# EAGLE board Clock_1 (EAGLE 9.6.2)
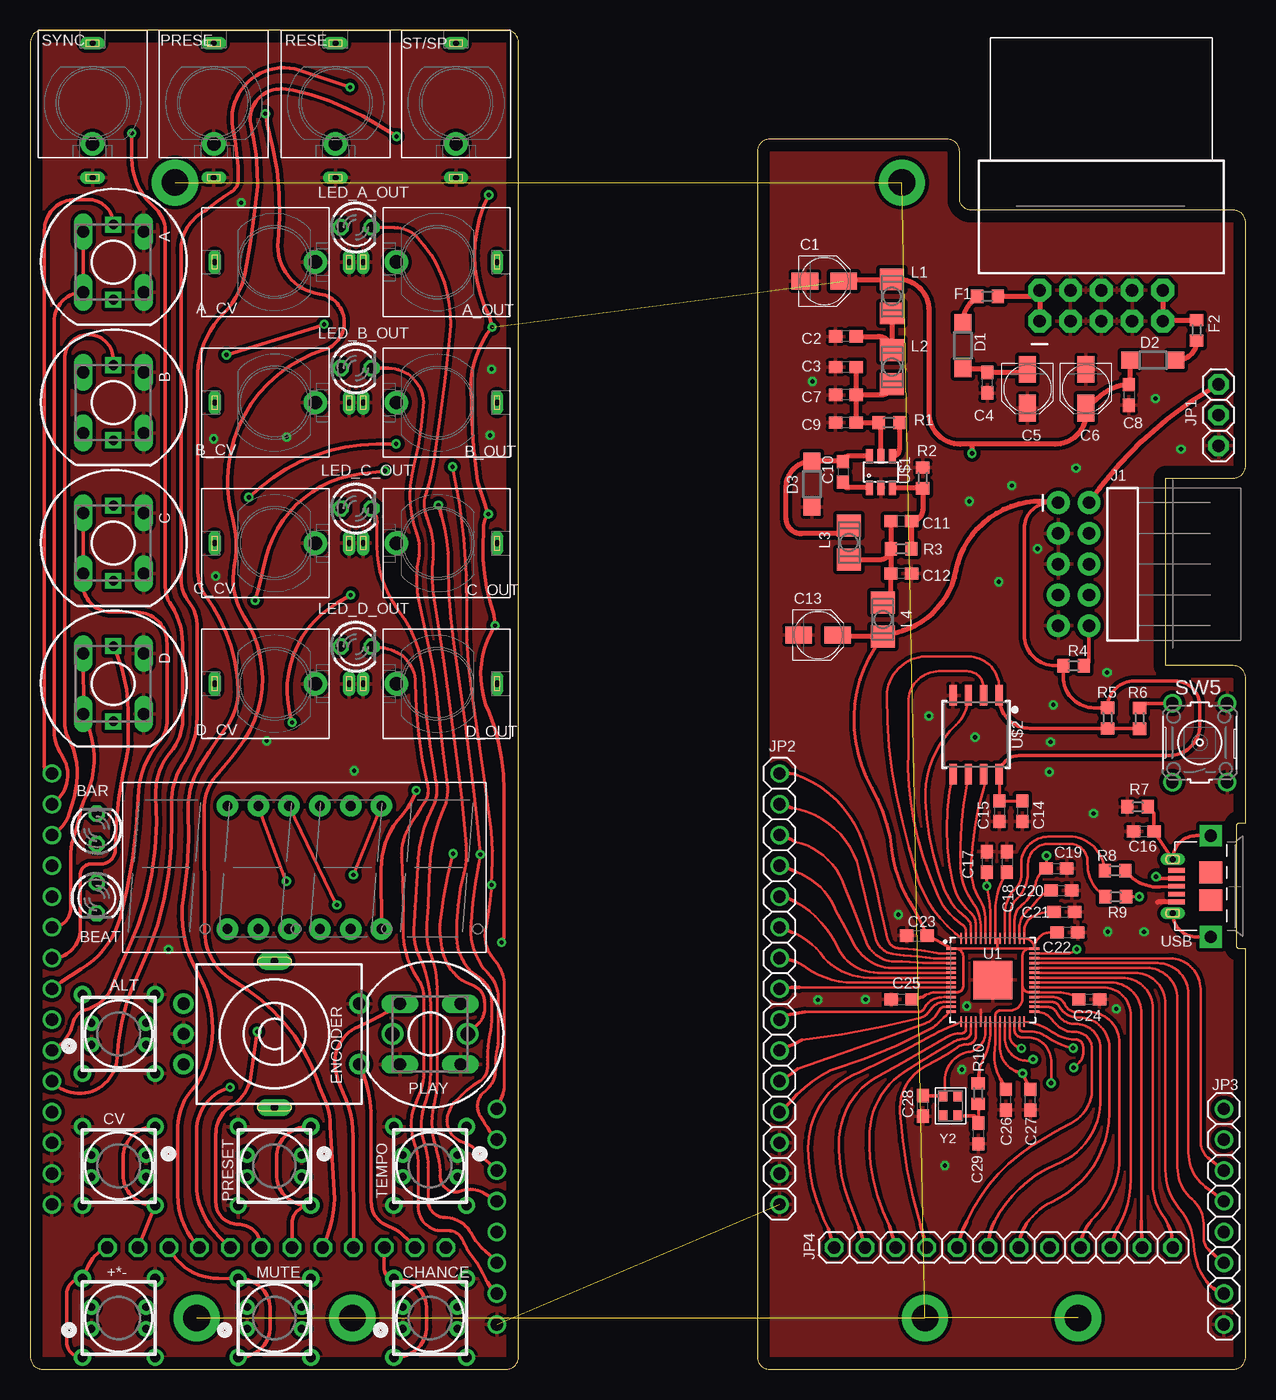
[diagram p2: board, top side]
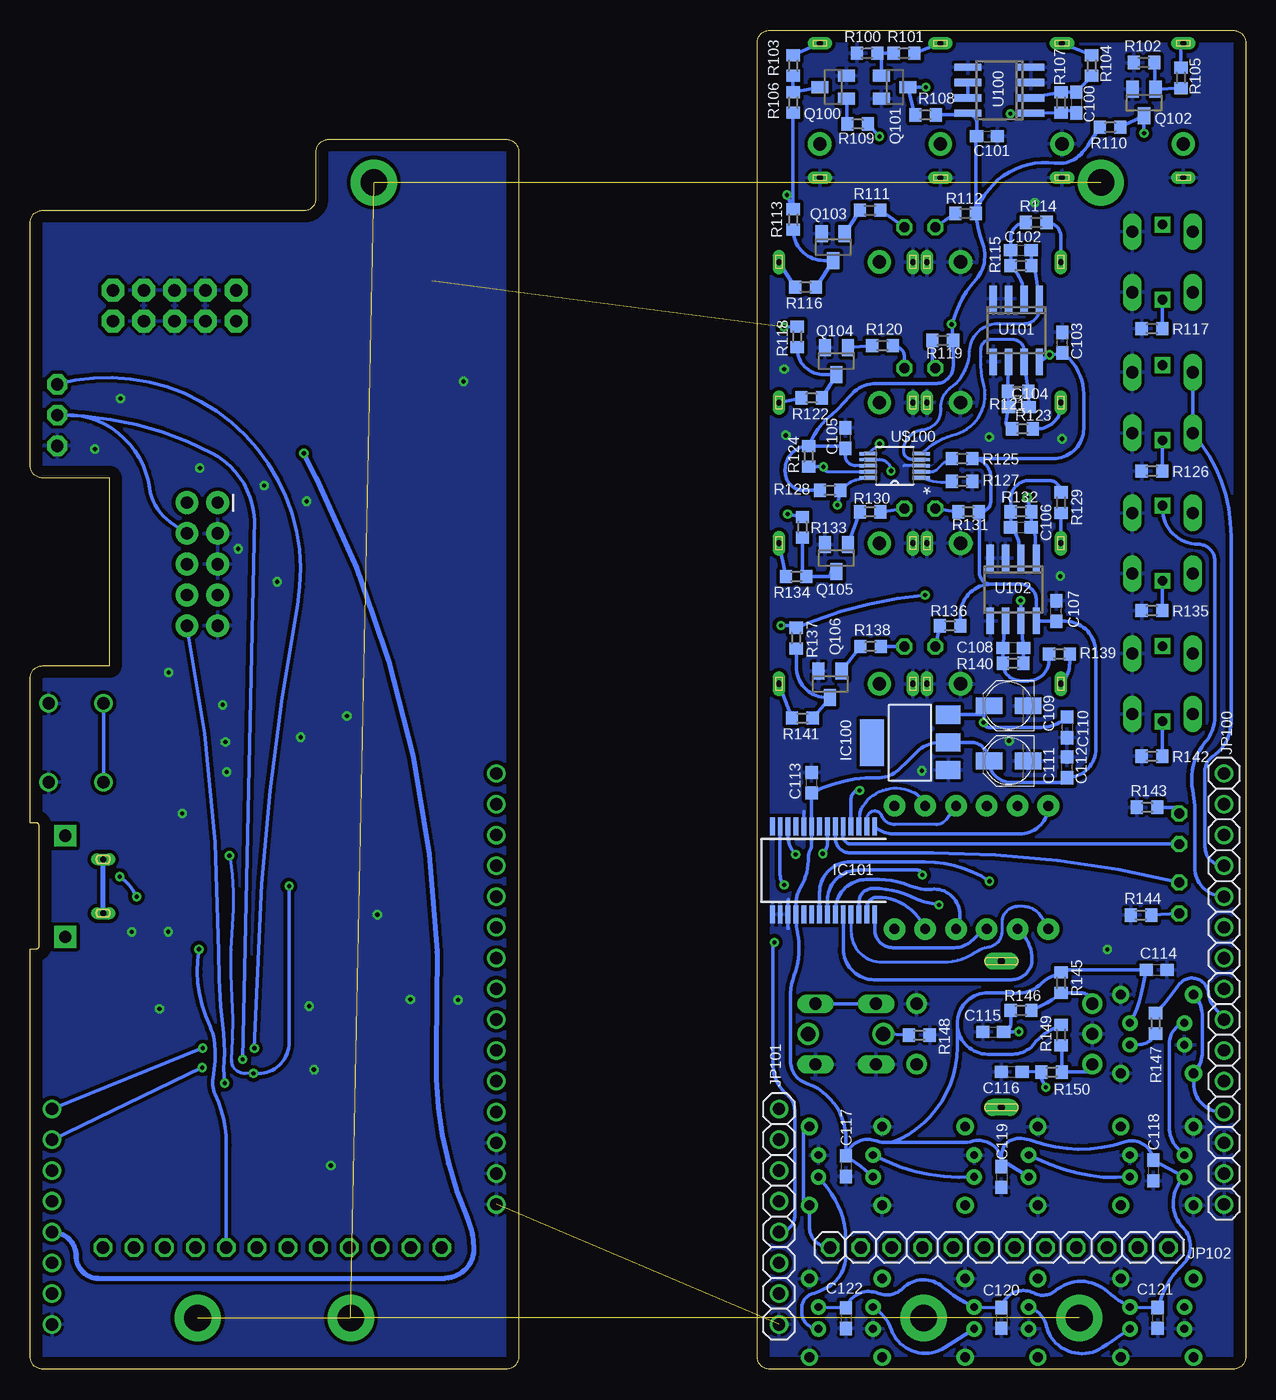
[diagram p3: board, bottom side, seen from below]

Size 100.3 x 110.5 mm. Coordinates in mm from the lower left corner, seen from the top.
Outline: 1,0 39.3,0 arc90 40.3,1 40.3,109.5 arc90 39.3,110.5 1,110.5 arc90 0,109.5 0,1 arc90 1,0
Outline: 61,0 99.3,0 arc90 100.3,1 100.3,34.69 99.82,34.69 arc-90 99.57,34.94 99.57,44.85 arc-90 99.82,45.1 100.3,45.1 100.3,57.06 arc90 99.3,58.06 93.73,58.06 93.73,73.55 99.3,73.55 arc90 100.3,74.55 100.3,94.65 arc90 99.3,95.65 77.7,95.65 arc-90 76.7,96.65 76.7,100.5 arc90 75.7,101.5 61,101.5 arc90 60,100.5 60,1 arc90 61,0
Copper layers (1*16): Top 0.035mm / dielectric 1.5mm / Bottom 0.035mm
Design rules "default": minimum track width 6mil, minimum drill 0.35mm, track to track 6mil, track to pad 6mil, pad to pad 6mil, via to via 6mil, smd to smd 6mil, copper to edge 40mil, drill to drill 6mil, minimum pad ring 10mil, minimum via ring 8mil, stop-mask expansion 4mil, vias tented up to drill 0mil, thermal gap 10mil

## Footprints (pad centres in the part's own frame; a part is rotated, then mirrored left to right if it is on the bottom)
BUTTON_PIXEL_ç = drill 0.8 pad 1.422: 1 -3,-3.25; 2 3,-3.25; 3 -3,3.25; 4 3,3.25 | drill 0.65 pad 1.27: DIN 2.25,-0.9; DOUT -2.25,0.9; GND -2.25,-0.9; VDD 2.25,0.9
TMEBUTTON = drill 1 long: 1 -2.5,2.5; 2 2.5,2.5; 3 -2.5,-2.5; 4 2.5,-2.5 | drill 0.8 square: P$1 -3.1,0; P$2 3.1,0
NOHOLER_GND_SHORT_PADMINI_GND = drill 0.5 pad 1.016 long: P1 0,-6.15; P3 0,4.92 | drill 1.1 pad 1.93: P2 0,-3.38
LED3MM = drill 0.813 octagon: A -1.27,0; K 1.27,0
PANASONIC_B = smd 2.2 x 1.4: + 1.6,0; - -1.6,0
C0603 = smd 1.1 x 1: 1 -0.85,0; 2 0.85,0
SOD123 = smd 1.4 x 1.4: A 1.9,0; C -1.9,0
CI-11 = drill 1 pad 1.676: A -2.5,-7.5; B 0,-7.5; C 2.5,-7.5; D -2.5,7; E 2.5,7 | drill 0.6 pad 1.422 long: C1 -6,0; C2 6.065,0
R0603 = smd 1 x 1.1: 1 -0.85,0; 2 0.85,0
SOT223 = smd 1.499 x 2.007: 1 -2.261,-3.15; 2 0.025,-3.15; 3 2.311,-3.15 | smd 3.81 x 2.007: 4 0,3.15
SSOP28 = smd 0.4 x 1.5: 1 -4.225,-3.625; 2 -3.575,-3.625; 3 -2.925,-3.625; 4 -2.275,-3.625; 5 -1.625,-3.625; 6 -0.975,-3.625; 7 -0.325,-3.625; 8 0.325,-3.625; 9 0.975,-3.625; 10 1.625,-3.625; 11 2.275,-3.625; 12 2.925,-3.625; 13 3.575,-3.625; 14 4.225,-3.625; 15 4.225,3.625; 16 3.575,3.625; 17 2.925,3.625; 18 2.275,3.625; 19 1.625,3.625; 20 0.975,3.625; 21 0.325,3.625; 22 -0.325,3.625; 23 -0.975,3.625; 24 -1.625,3.625; 25 -2.275,3.625; 26 -2.925,3.625; 27 -3.575,3.625; 28 -4.225,3.625
2X5-RA = drill 1.016 pad 1.88: 1 -1.27,5.08; 2 1.27,5.08; 3 -1.27,2.54; 4 1.27,2.54; 5 -1.27,0; 6 1.27,0; 7 -1.27,-2.54; 8 1.27,-2.54; 9 -1.27,-5.08; 10 1.27,-5.08
1X3* = drill 1.016 pad 1.676 octagon: 1 -2.54,0; 2 0,0; 3 2.54,0
1X15ç = drill 1.016: 1 -17.78,0; 2 -15.24,0; 3 -12.7,0; 4 -10.16,0; 5 -7.62,0; 6 -5.08,0; 7 -2.54,0; 8 0,0; 9 2.54,0; 10 5.08,0; 11 7.62,0; 12 10.16,0; 13 12.7,0; 14 15.24,0; 15 17.78,0
1X8ç = drill 1.016: 1 -8.89,0; 2 -6.35,0; 3 -3.81,0; 4 -1.27,0; 5 1.27,0; 6 3.81,0; 7 6.35,0; 8 8.89,0
1X12Ç = drill 1.016 octagon: 1 -13.97,0; 2 -11.43,0; 3 -8.89,0; 4 -6.35,0; 5 -3.81,0; 6 -1.27,0; 7 1.27,0; 8 3.81,0; 9 6.35,0; 10 8.89,0; 11 11.43,0; 12 13.97,0
L3225P = smd 1.8 x 2: 1 -1.4,0; 2 1.4,0
7-SEGMENT-4DIGIT-30MM = drill 0.8 pad 1.778: 1 -6.35,-5.08; 2 -3.81,-5.08; 3 -1.27,-5.08; 4 1.27,-5.08; 5 3.81,-5.08; 6 6.35,-5.08; 7 6.35,5.08; 8 3.81,5.08; 9 1.27,5.08; 10 -1.27,5.08; 11 -3.81,5.08; 12 -6.35,5.08
TIMEBUTTON_HOLES_LEDS = drill 1 long: 1 -2.5,2.5; 2 2.5,2.5; 3 -2.5,-2.5; 4 2.5,-2.5 | drill 1.2: P$1 -3.1,0; P$2 3.1,0
2X5-POWER_ACODADO = drill 1.016 pad 1.88 octagon: 1 -1.27,5.08; 2 1.27,5.08; 3 -1.27,2.54; 4 1.27,2.54; 5 -1.27,0; 6 1.27,0; 7 -1.27,-2.54; 8 1.27,-2.54; 9 -1.27,-5.08; 10 1.27,-5.08
SOT23 = smd 1 x 1.4: 1 -0.95,-1.1; 2 0.95,-1.1; 3 0,1.1
B3F-10XX = drill 1.016: 1 -3.251,2.261; 2 3.251,2.261; 3 -3.251,-2.261; 4 3.251,-2.261
QFN-56 = smd 0.875 x 0.2: 1 -3.437,2.6; 2 -3.437,2.2; 3 -3.437,1.8; 4 -3.437,1.4; 5 -3.437,1; 6 -3.437,0.6; 7 -3.437,0.2; 8 -3.437,-0.2; 9 -3.437,-0.6; 10 -3.437,-1; 11 -3.437,-1.4; 12 -3.437,-1.8; 13 -3.437,-2.2; 14 -3.437,-2.6; 29 3.437,-2.6; 30 3.437,-2.2; 31 3.437,-1.8; 32 3.437,-1.4; 33 3.437,-1; 34 3.437,-0.6; 35 3.437,-0.2; 36 3.437,0.2; 37 3.437,0.6; 38 3.437,1; 39 3.437,1.4; 40 3.437,1.8; 41 3.437,2.2; 42 3.437,2.6 | smd 0.2 x 0.875: 15 -2.6,-3.437; 16 -2.2,-3.437; 17 -1.8,-3.437; 18 -1.4,-3.437; 19 -1,-3.437; 20 -0.6,-3.437; 21 -0.2,-3.437; 22 0.2,-3.437; 23 0.6,-3.437; 24 1,-3.437; 25 1.4,-3.437; 26 1.8,-3.437; 27 2.2,-3.437; 28 2.6,-3.437; 43 2.6,3.437; 44 2.2,3.437; 45 1.8,3.437; 46 1.4,3.437; 47 1,3.437; 48 0.6,3.437; 49 0.2,3.437; 50 -0.2,3.437; 51 -0.6,3.437; 52 -1,3.437; 53 -1.4,3.437; 54 -1.8,3.437; 55 -2.2,3.437; 56 -2.6,3.437 | smd 3.2 x 3.2: EPAD 0,0
SO08 = smd 0.6 x 2.2: 1 -1.905,-2.6; 2 -0.635,-2.6; 3 0.635,-2.6; 4 1.905,-2.6; 5 1.905,2.6; 6 0.635,2.6; 7 -0.635,2.6; 8 -1.905,2.6
SOT23-6 = smd 0.55 x 1.2: 1 -0.95,-1.3; 2 0,-1.3; 3 0.95,-1.3; 4 0.95,1.3; 5 0,1.3; 6 -0.95,1.3
SOIC-8 = smd 0.61 x 1.702: 1 -1.905,-3.251; 2 -0.635,-3.251; 3 0.635,-3.251; 4 1.905,-3.251; 5 1.905,3.251; 6 0.635,3.251; 7 -0.635,3.251; 8 -1.905,3.251
ADC-4CH-ADS1115-VSSOP = smd 1.422 x 0.279: 1 -2.184,0.991; 2 -2.184,0.508; 3 -2.184,0; 4 -2.184,-0.508; 5 -2.184,-0.991; 6 2.184,-0.991; 7 2.184,-0.508; 8 2.184,0; 9 2.184,0.508; 10 2.184,0.991
HRS_ZX62RD-AB-5P8 = smd 0.4 x 1.35: 1 1.3,2.275; 2 0.65,2.275; 3 0,2.275; 4 -0.65,2.275; 5 -1.3,2.275 | smd 1.8 x 1.9: D_0 -1.15,-0.525; D_1 1.15,-0.525 | drill 1 pad 1.8 square: G -4.175,-0.525; G2 4.175,-0.525 | drill 0.5 long: G3 -2.225,2.6; G4 2.225,2.6
CRYSTAL_2.5X2 = smd 0.9 x 0.75: 1 -0.825,-0.625; 2 0.825,-0.625; 3 0.825,0.625; 4 -0.825,0.625

## Placement (x,y rotation side)
+*-  BUTTON_NEOPIXELBUTTON_PIXEL_ç  [BUTTON_PIXEL_ç]  7.3,4.23 0 top
A  DTS-6_LEDTME  [TMEBUTTON]  6.85,91.37 270 top
A_CV  OG-PJ301_PJ301_THONKICONNNOHOLER  [NOHOLER_GND_SHORT_PADMINI_GND]  20.15,91.37 90 top
A_OUT  OG-PJ301_PJ301_THONKICONNNOHOLER  [NOHOLER_GND_SHORT_PADMINI_GND]  33.6,91.37 270 top
ALT  BUTTON_NEOPIXELBUTTON_PIXEL_ç  [BUTTON_PIXEL_ç]  7.3,27.67 0 top
B  DTS-6_LEDTME  [TMEBUTTON]  6.85,79.77 270 top
B_CV  OG-PJ301_PJ301_THONKICONNNOHOLER  [NOHOLER_GND_SHORT_PADMINI_GND]  20.15,79.77 90 top
B_OUT  OG-PJ301_PJ301_THONKICONNNOHOLER  [NOHOLER_GND_SHORT_PADMINI_GND]  33.6,79.77 270 top
BAR  2 MM LED  [LED3MM]  5.48,44.6 90 top
BEAT  2 MM LED  [LED3MM]  5.48,38.89 270 top
C  DTS-6_LEDTME  [TMEBUTTON]  6.85,68.17 270 top
C1  10uF  [PANASONIC_B]  65.53,89.81 0 top
C2  10n  [C0603]  67.31,85.23 180 top
C3  100n  [C0603]  67.31,82.69 180 top
C4  100n  [C0603]  78.99,81.42 90 top
C5  10uF  [PANASONIC_B]  82.3,80.92 270 top
C6  10uF  [PANASONIC_B]  87.12,80.92 270 top
C7  10uF  [C0603]  67.31,80.41 180 top
C8  100n  [C0603]  90.68,80.41 270 top
C9  100n  [C0603]  67.31,78.12 180 top
C10  100n  [C0603]  67.06,74.06 270 top
C11  100n  [C0603]  71.88,69.99 180 top
C12  22uF  [C0603]  71.88,65.68 180 top
C13  10uF  [PANASONIC_B]  65.02,60.6 0 top
C14  2.2uF  [C0603]  81.87,46.05 270 top
C15  100n  [C0603]  79.97,46.05 270 top
C16  10n  [C0603]  91.89,44.37 180 top
C17  100n  [C0603]  78.94,41.87 270 top
C18  100n  [C0603]  80.61,41.86 270 top
C19  2.2uF  [C0603]  84.68,41.32 0 top
C20  2.2uF  [C0603]  85.09,39.51 0 top
C21  2.2uF  [C0603]  85.34,37.74 0 top
C22  100n  [C0603]  85.6,36.05 180 top
C23  100n  [C0603]  73.18,35.78 0 top
C24  100n  [C0603]  87.39,30.53 180 top
C25  100n  [C0603]  71.91,30.53 0 top
C26  100n  [C0603]  80.52,22.24 90 top
C27  100n  [C0603]  82.55,22.24 90 top
C28  22pF  [C0603]  73.66,21.73 90 top
C29  22pF  [C0603]  78.23,19.45 270 top
C100  100pF  [C0603]  13.97,104.54 270 bottom
C101  100n  [C0603]  21.34,101.74 0 bottom
C102  100pF  [C0603]  18.54,92.35 0 bottom
C103  100n  [C0603]  15.11,84.73 90 bottom
C104  100pF  [C0603]  18.72,79.39 0 bottom
C105  100n  [C0603]  33.02,76.85 90 bottom
C106  100pF  [C0603]  18.54,69.49 0 bottom
C107  100n  [C0603]  15.62,62.58 90 bottom
C108  100pF  [C0603]  19.18,59.53 0 bottom
C109  10uF  [PANASONIC_B]  19.56,54.75 180 bottom
C110  100n  [C0603]  14.73,52.98 270 bottom
C111  10uF  [PANASONIC_B]  19.56,50.18 180 bottom
C112  100n  [C0603]  14.73,49.67 90 bottom
C113  100n  [C0603]  35.81,48.4 90 bottom
C114  100n  [C0603]  7.34,32.96 0 bottom
C115  100nF  [C0603]  20.83,27.83 0 bottom
C116  100nF  [C0603]  19.3,24.53 180 bottom
C117  100n  [C0603]  32.99,16.76 270 bottom
C118  100n  [C0603]  7.62,16.4 270 bottom
C119  100n  [C0603]  20.14,15.87 270 bottom
C120  100n  [C0603]  20.14,4.23 270 bottom
C121  100n  [C0603]  7.26,4.23 270 bottom
C122  100n  [C0603]  32.99,4.22 270 bottom
C_CV  OG-PJ301_PJ301_THONKICONNNOHOLER  [NOHOLER_GND_SHORT_PADMINI_GND]  20.15,68.17 90 top
C_OUT  OG-PJ301_PJ301_THONKICONNNOHOLER  [NOHOLER_GND_SHORT_PADMINI_GND]  33.6,68.17 270 top
CHANCE  BUTTON_NEOPIXELBUTTON_PIXEL_ç  [BUTTON_PIXEL_ç]  33,4.23 0 top
CV  BUTTON_NEOPIXELBUTTON_PIXEL_ç  [BUTTON_PIXEL_ç]  7.3,16.77 180 top
D  DTS-6_LEDTME  [TMEBUTTON]  6.85,56.57 270 top
D1  SS1040_R1_00001  [SOD123]  76.96,84.47 270 top
D2  SS1040_R1_00001  [SOD123]  92.66,83.26 0 top
D3  SS1040_R1_00001  [SOD123]  64.52,73.04 270 top
D_CV  OG-PJ301_PJ301_THONKICONNNOHOLER  [NOHOLER_GND_SHORT_PADMINI_GND]  20.15,56.57 90 top
D_OUT  OG-PJ301_PJ301_THONKICONNNOHOLER  [NOHOLER_GND_SHORT_PADMINI_GND]  33.6,56.57 270 top
ENCODER  CI-11  [CI-11]  20.15,27.67 270 top
F1  F2  [R0603]  78.99,88.54 0 top
F2  F1  [R0603]  96.27,85.74 90 top
IC100  LM1117-3.3  [SOT223]  27.69,51.71 90 bottom
IC101  MCP23017SS  [SSOP28]  34.84,41.16 180 bottom
J1  [2X5-RA]  86.11,66.44 0 top
JP1  [1X3*]  98.07,78.75 90 top
JP2  [1X15ç]  61.83,31.39 270 top
JP3  [1X8ç]  98.51,12.59 270 top
JP4  [1X12Ç]  80.32,10.05 0 top
JP100  [1X15ç]  1.78,31.39 270 bottom
JP101  [1X8ç]  38.51,12.59 270 bottom
JP102  [1X12Ç]  20.32,10.05 180 bottom
L1  0.1uH  [L3225P]  71.12,88.54 270 top
L2  0.1uH  [L3225P]  71.12,82.69 270 top
L3  4.7uH  [L3225P]  67.56,68.22 270 top
L4  0.1uH  [L3225P]  70.36,61.87 270 top
LED_A_OUT  2 MM LED  [LED3MM]  26.88,94.24 0 top
LED_B_OUT  2 MM LED  [LED3MM]  26.88,82.62 0 top
LED_C_OUT  2 MM LED  [LED3MM]  26.88,71.04 0 top
LED_D_OUT  2 MM LED  [LED3MM]  26.88,59.64 0 top
LFD36BUE-101B  7-SEGMENT-4DIGIT-20MM  [7-SEGMENT-4DIGIT-30MM]  22.63,41.41 0 top
MUTE  BUTTON_NEOPIXELBUTTON_PIXEL_ç  [BUTTON_PIXEL_ç]  20.15,4.23 0 top
PLAY  DTS-6_LED  [TIMEBUTTON_HOLES_LEDS]  33,27.67 180 top
POWER  M05X2RAF  [2X5-POWER_ACODADO]  88.39,87.77 90 top
PRESE  OG-PJ301_PJ301_THONKICONNNOHOLER  [NOHOLER_GND_SHORT_PADMINI_GND]  15.15,104.5 0 top
PRESET  BUTTON_NEOPIXELBUTTON_PIXEL_ç  [BUTTON_PIXEL_ç]  20.15,16.77 180 top
Q100  BC846  [SOT23]  34.04,105.81 90 bottom
Q101  BC846  [SOT23]  28.96,105.81 270 bottom
Q102  BC846  [SOT23]  8.38,104.54 180 bottom
Q103  BC846  [SOT23]  34.04,92.6 180 bottom
Q104  BC846  [SOT23]  33.78,83.2 180 bottom
Q105  BC846  [SOT23]  33.78,66.95 180 bottom
Q106  BC846  [SOT23]  34.29,56.53 180 bottom
R1  100k  [R0603]  70.87,78.12 0 top
R2  16k2  [R0603]  73.66,73.55 270 top
R3  49k9  [R0603]  71.88,67.71 0 top
R4  1k  [R0603]  86.11,58.06 0 top
R5  10k  [R0603]  88.9,53.74 90 top
R6  1k  [R0603]  91.56,53.71 90 top
R7  1M  [R0603]  91.39,46.41 0 top
R8  27 Ohm  [R0603]  89.52,41.14 180 top
R9  27 Ohm  [R0603]  89.59,38.99 0 top
R10  1k  [R0603]  78.23,22.75 90 top
R100  1M  [R0603]  31.24,108.6 0 bottom
R101  100k  [R0603]  28.19,108.6 0 bottom
R102  1M  [R0603]  8.38,107.84 0 bottom
R103  100R  [R0603]  37.34,107.59 90 bottom
R104  100k  [R0603]  12.7,107.59 90 bottom
R105  100k  [R0603]  5.33,106.57 90 bottom
R106  1k  [R0603]  37.34,104.54 90 bottom
R107  33k  [R0603]  15.24,104.54 90 bottom
R108  10k  [R0603]  26.42,103.52 0 bottom
R109  1k  [R0603]  32,102.76 0 bottom
R110  10k  [R0603]  11.18,102.51 180 bottom
R111  1k  [R0603]  30.99,95.65 0 bottom
R112  470R  [R0603]  23.11,95.39 180 bottom
R113  1k  [R0603]  37.34,94.89 270 bottom
R114  100k  [R0603]  17.27,94.63 0 bottom
R115  33k  [R0603]  18.54,91.08 180 bottom
R116  100R  [R0603]  36.32,89.3 180 bottom
R117  100 Ohm  [R0603]  7.73,85.88 180 bottom
R118  1k  [R0603]  36.99,85.2 270 bottom
R119  470R  [R0603]  24.99,84.91 180 bottom
R120  1k  [R0603]  29.97,84.47 0 bottom
R121  33k  [R0603]  18.77,80.71 180 bottom
R122  100R  [R0603]  35.81,80.15 180 bottom
R123  100k  [R0603]  18.41,77.61 0 bottom
R124  10k  [R0603]  36.07,75.33 270 bottom
R125  10k  [R0603]  23.39,75.15 180 bottom
R126  100 Ohm  [R0603]  7.73,74.12 180 bottom
R127  10k  [R0603]  23.39,73.27 0 bottom
R128  10k  [R0603]  34.29,72.53 0 bottom
R129  100k  [R0603]  15.24,71.52 270 bottom
R130  1k  [R0603]  30.99,70.76 0 bottom
R131  470R  [R0603]  22.86,70.76 180 bottom
R132  33k  [R0603]  18.54,70.76 180 bottom
R133  1k  [R0603]  36.58,69.49 270 bottom
R134  100R  [R0603]  37.08,65.42 180 bottom
R135  100 Ohm  [R0603]  7.73,62.61 180 bottom
R136  470R  [R0603]  24.38,61.36 180 bottom
R137  1k  [R0603]  37.08,60.34 270 bottom
R138  1k  [R0603]  30.94,59.65 0 bottom
R139  100k  [R0603]  15.37,59.02 0 bottom
R140  33k  [R0603]  19.18,58.26 180 bottom
R141  100R  [R0603]  36.58,53.74 180 bottom
R142  100 Ohm  [R0603]  7.73,50.59 180 bottom
R143  1k  [R0603]  8.13,46.37 0 bottom
R144  1k  [R0603]  8.64,37.48 0 bottom
R145  10k  [R0603]  15.24,31.89 270 bottom
R146  10k  [R0603]  18.54,29.61 180 bottom
R147  560 Ohm  [R0603]  7.44,28.54 270 bottom
R148  100 Ohm  [R0603]  26.92,27.58 0 bottom
R149  10k  [R0603]  15.24,27.58 270 bottom
R150  10k  [R0603]  16,24.53 0 bottom
RESE  OG-PJ301_PJ301_THONKICONNNOHOLER  [NOHOLER_GND_SHORT_PADMINI_GND]  25.18,104.5 0 top
ST/SP  OG-PJ301_PJ301_THONKICONNNOHOLER  [NOHOLER_GND_SHORT_PADMINI_GND]  35.13,104.5 0 top
SW5  [B3F-10XX]  96.52,51.71 90 top
SYNC  OG-PJ301_PJ301_THONKICONNNOHOLER  [NOHOLER_GND_SHORT_PADMINI_GND]  5.14,104.5 0 top
TEMPO  BUTTON_NEOPIXELBUTTON_PIXEL_ç  [BUTTON_PIXEL_ç]  33,16.77 180 top
U1  RP2040  [QFN-56]  79.43,32.11 0 top
U100  MCP6002_  [SO08]  20.32,105.55 90 bottom
U101  MCP6002_  [SO08]  18.92,85.74 180 bottom
U102  MCP6002_  [SO08]  19.18,64.36 180 bottom
U$1  BL9342  [SOT23-6]  70.2,74.04 0 top
U$2  W25Q128JVSIQ  [SOIC-8]  78.06,52.37 180 top
U$100  ADC-4CH-ADS1115VSSOP  [ADC-4CH-ADS1115-VSSOP]  28.96,74.57 180 bottom
USB  [HRS_ZX62RD-AB-5P8]  96.89,39.86 90 top
Y2  12MHZ  [CRYSTAL_2.5X2]  75.95,21.73 90 top

## Tracks (layer width: path | path; a pad name or v marks a point on that pad's centre or on a via)
+3V3  (via drill 0.35)
  Top 0.305: v16.18,83.71 23.62,86 v24.26,86.24
  Bottom 0.254: U$100.8 32.21,74.57 arc90 33.02,75.38 C105.1
  Bottom 0.305: R108.2 22.86,103.53 | 22.86,103.53 U100.8 | C107.1 15.8,61.73 | 15.8,61.73 U102.8 17.27,63.47 arc-90 18.59,64.79 20.99,64.79 | CHANCE.VDD C122.1 arc93 30.33,6.27 arc-68 28.3,6.67 arc87 24.97,6.77 arc-14 23.16,5.53 MUTE.VDD C120.1 arc104 17.48,6.29 arc-66 15.7,6.47 arc7 15.27,6.77 arc74 11.38,6.39 arc-12 10.19,5.5 +*-.VDD C121.1 6.91,6.04 arc26 5.23,8.58 arc-90 5.16,11.68 arc90 CV.VDD C118.1 arc-102 9.98,18.76 arc38 17.58,18.84 arc-20 18.75,19.04 arc-90 20.14,17.64 C119.1 | PRESET.VDD 20.14,17.29 C119.1 | R110.2 12.83,101.29 arc6 13.46,100.42 arc58 15.72,99.53 arc-80 R112.1 | R112.1 22.26,101.74 C101.1 22.19,102.86 arc-90 22.86,103.53 | R112.1 arc-14 21.69,92.85 arc62 22.28,89.91 arc-22 23.88,87.27 v24.26,86.24 R119.1 24.13,82.97 arc0 24.13,82.77 arc92 25.6,81.35 30.45,81.35 arc-50 32.66,80.31 arc10 34.19,78.76 arc-27 R124.1 | U101.8 v16.18,83.71 C103.1 arc59 13.36,80.08 13.36,77.61 arc90 15.9,75.15 R125.1 arc90 21.03,73.56 21.03,71.56 arc90 R131.1 arc90 21.97,70.72 21.97,65.76 arc-90 20.99,64.79 | R128.1 36.45,72.53 arc90 38,74.08 38,74.25 arc90 R124.1 | C105.1 arc-90 33.2,76.18 R124.1 | 20.99,64.79 arc-90 23.53,62.25 R136.1 | ALT.VDD arc-18 8.61,31.01 C114.1 15.24,32.96 R145.1 16.15,32.33 arc-20 16.82,31.87 arc52 19.2,31.06 21.26,31.06 arc-90 23.8,28.52 | 23.8,28.52 23.8,26.53 arc69 29.18,18.71 | R149.1 16.05,28.01 arc-21 17.3,27.04 arc56 19.2,26 21.29,26 arc90 23.8,28.52 | C117.1 32.99,18.91 arc-71 36.14,23.56 arc75 37.57,25.47 37.57,30.65 arc21 37.26,32.48 arc-26 36.88,35.3 37.09,36.59 IC101.18 37.11,38.42 arc31 36.73,39.77 arc-31 36.09,42 arc22 35.92,42.89 arc-26 35.81,43.5 IC101.9 IC101.9 arc45 IC101.9 C113.1 arc29 30.43,48.81 arc-44 28.65,49.47 arc-1 28.35,49.75 arc-2 27.66,50.41 27.08,50.99 arc45 25.29,51.73 IC100.2 22.71,51.73 arc90 C111.+ arc-90 19.41,48.43 15.13,48.43 arc-90 C112.1 arc-90 12.37,51.19 12.37,59.19 arc-90 14.91,61.73 15.8,61.73
  Bottom 0.305: TEMPO.VDD 31.75,16.73 arc-11 C117.1 | 29.18,18.71 29.79,18.71 arc21 30.48,18.84 arc-94 C117.1 | C119.1 arc-111 22.45,18.84 arc13 23.57,18.71 29.18,18.71
+12V  (via drill 0.35)  (1 unrouted)
  Top 0.305: v38.89,35.22 arc45 39.12,35.86 39.12,47.77 arc22 37.85,54.22 arc-57 v38.35,61.38 38.28,62.25 arc-24 37.41,69.18 arc-42 v37.8,70.58 36.93,73.25 arc-9 36.37,81.73 arc-31 v38.1,86 37.9,86.89 arc-54 v37.85,96.92 | v26.44,63.9 25.32,63.24 arc78 v21.61,53.38
  Top 0.406: C1.+ 67.13,89.94 L1.1 71.65,89.94 arc-90 74.19,87.4 74.19,78.88 arc90 76.73,76.34 77.72,76.34 | D2.C 90.76,81.34 | 90.76,81.34 arc-90 C8.1 | 90.76,81.34 arc36 88.32,80.33 C6.+ 87.12,78.88 arc-90 84.58,76.34 77.72,76.34 | 77.72,76.34 v77.72,75.58
  Bottom 0.305: R106.1 R113.1 v37.85,96.92 | v37.8,70.58 R133.1 | v38.1,86 R118.1 | v38.35,61.38 37.02,61.38 arc90 R137.1 35.53,61.79 arc16 v26.44,63.9 | IC100.3 21.89,54.02 arc-90 C109.+ arc-90 21.61,54.3 v21.61,53.38 arc-90 21.21,52.98 16.84,52.98 arc-44 C110.1 | JP101.5 arc-90 37.21,12.61 37.21,21.38 arc-52 37.82,22.62 arc50 39.01,25.29 39.01,34.91 arc45 v38.89,35.22 | 96.52,9.33 96.52,9.29
  Bottom 0.406: JP3.5 arc90 96.52,9.33 arc-90 94.7,7.51 66.04,7.51 arc-90 63.7,10.02 arc-21 64.26,12.54 arc25 66.8,26.31 arc-29 76.71,73.55 v77.72,75.58
+*-_B
  Top 0.2: U1.15 76.2,28.39 arc1 74.88,27.78 arc4 74.04,27.35 arc-5 68.51,24.56 arc70 64.19,18.18 arc18 64.92,13.88 arc7 65.85,11.59
  Top 0.305: 65.85,11.59 JP4.1
+*-_T
  Top 0.305: +*-.1 arc-90 3,2.28 3,6.18 arc-90 +*-.3 4.78,8.53 arc-43 JP102.1
-12V
  Top 0.406: D1.A 78.28,82.57 arc-45 C4.2 81.71,82.27 arc45 C5.-
A_B
  Top 0.2: U1.3 74.93,33.91 arc-8 73.92,33.98 arc4 72.09,34.16 arc-6 71.2,34.26 arc-66 69.75,35.58 arc-2 68.53,40.61 arc72 62.85,46.34
  Top 0.305: 62.85,46.34 arc8 JP2.2
A_CV
  Bottom 0.254: U$100.4 27.51,75.07 arc90 28.22,75.78 arc85 26.62,77.54 arc-89 25.15,79.29 arc57 24.43,80.92 arc-54 22.78,83.99 arc90 20.3,86.3 18.24,86.3 arc-90 16.99,87.55 16.99,88.32 arc-90 U101.1
  Bottom 0.305: C102.2 R115.1 arc90 17.4,90.78 U101.1
A_OUT_B
  Top 0.2: 97.27,17.39 arc-51 96.58,18.82 96.58,31.38 arc90 94.04,33.91 U1.40
  Top 0.305: 97.27,17.39 arc0 JP3.3
A_OUT_T
  Top 0.254: 30.07,94.23 arc-47 32,93.36 arc-48 34.62,85.31 arc-2 33.27,74.92 arc-7 32.87,72.99 arc-5 32.69,72.43 arc43 32.74,70.2 arc-28 33.22,67 arc14 33.33,63.49 arc-1 34.39,56.33 arc-1 35.38,48.84 arc-2 35.92,43.68 arc-5 35.97,42.33 arc-14 35.79,40.99 arc16 35.18,35.53 arc57 37.03,32.35 arc-59 38.05,30.34 38.05,29.15 arc-15 37.92,27.58 arc15 37.72,25.75 arc-1 37.72,24.88 arc-58 37.08,23.77 arc16 35.13,22.17 arc19 34.54,21.28 arc97 35.69,18.76 arc-37 36.93,17.87 arc20 37.64,17.19
  Top 0.305: LED_A_OUT.K 30.07,94.23 | 37.64,17.19 arc-17 JP101.3
  Bottom 0.305: LED_A_OUT.K R111.2
A_T
  Top 0.305: A.3 A.4 arc90 1.98,86.5 1.98,52.67 arc34 2.59,50.69 arc-91 JP100.2
ALT_B
  Top 0.2: U1.14 75.59,29.18 arc6 74.93,28.57 arc-18 74.22,28.04 arc-11 66.03,24.67 arc17 63.24,22.65
  Top 0.305: 63.24,22.65 arc-11 JP2.12
ALT_T
  Bottom 0.305: ALT.1 | ALT.1 arc-45 3.56,26.21 3.56,29.12 arc-45 ALT.3 | ALT.3 | ALT.1 4.29,23.56 arc-93 JP100.12
B_B
  Top 0.2: U1.5 74.42,33.12 71.17,33.12 arc-61 68.08,34.95 arc0 66.5,37.82 arc49 63.2,41.05
  Top 0.305: 63.2,41.05 arc14 JP2.4
B_CV
  Bottom 0.254: U$100.5 26.19,76.04 arc24 24.21,77.08 arc-89 21.57,81.09 arc18 21.84,83.53 21.84,84.14 arc90 20.98,85 19.25,85 arc90 18.29,84.04 U101.7
  Bottom 0.305: U101.7 R121.1 C104.2
B_OUT_B
  Top 0.2: 97.03,15.03 arc-54 95.58,17.87 95.58,30.98 arc90 93.05,33.52 U1.39
  Top 0.305: 97.03,15.03 arc-5 JP3.4
B_OUT_T
  Top 0.254: 29.54,82.62 arc-94 32.44,79.52 arc-11 31.62,74.52 arc34 31.88,68.95 arc-31 32.03,66.92 arc23 32.05,63.44 33.12,58.46 arc-7 33.53,55.8 arc3 34.39,48.3 arc-32 34.09,46.19 arc23 32.94,41.27 arc-2 32.72,36.74 arc26 33.12,34 arc-22 33.55,31.41 33.55,31.39 33.55,23.61 arc-15 33.33,21.86 arc30 33.33,18.81 arc-1 33.66,17.52 arc-16 33.81,15.99 arc113 35.56,14.72 arc-53 37.47,14.52
  Top 0.305: LED_B_OUT.K 29.54,82.62 | 37.47,14.52 arc1 JP101.4
  Bottom 0.305: R120.2 arc90 28.15,83.5 LED_B_OUT.K
B_T
  Bottom 0.305: B.3 B.4 arc41 1.19,68.72 1.19,53.38 arc55 2.69,50.59 arc-56 3.35,49.34 3.35,43.12 arc-90 JP100.4
C_B
  Top 0.2: U1.9 70.36,31.52 63.46,31.51
  Top 0.305: 63.46,31.51 62.82,31.49 JP2.8
C_CV  (via drill 0.35)
  Top 0.305: v30.2,76.37 28.57,76.34 arc43 v18.03,71.95
  Bottom 0.254: U$100.6 v30.2,76.37
  Bottom 0.305: v18.03,71.95 R132.1 C106.2 arc90 17.4,69.19 U102.1
C_OUT_B
  Top 0.2: 97.31,9.8 arc-48 96.84,10.84 96.84,12.02 arc47 95.89,14.02 arc-49 94.68,16.66 94.68,30.58 arc90 92.14,33.12 U1.38
  Top 0.305: 97.31,9.8 arc3 JP3.6
C_OUT_T
  Top 0.254: 28.63,69.82 28.63,67.91 arc36 30.33,62.73 arc-34 32.51,56.51 arc9 33.4,48.84 arc1 33.48,48.45 arc-39 33.2,46.4 arc23 32,42.16 arc2 31.65,36.24 arc29 32.13,33.95 arc-26 33.02,29.99 33.02,24.48 arc-22 32.61,22.09 arc40 32.51,18.69 arc-20 32.82,16.63 32.82,13.94 arc90 34.21,12.54 arc-61 36.32,11.3 arc20 37.59,9.72
  Top 0.305: 28.63,69.82 arc42 LED_C_OUT.K | 37.59,9.72 arc-9 JP101.6
  Bottom 0.305: LED_C_OUT.K R130.2
C_T
  Top 0.305: C.3 C.4 4.35,64.83 arc90 6.71,62.48 8.84,62.48 arc-90 11.28,59.91 11.28,53.53 arc-41 10.79,52.01 arc40 8.89,47.13 arc-14 7.42,37.25 arc-43 4.22,33.04 arc6 JP100.8
CHAN_B
  Top 0.2: 89.81,11.74 arc29 90.83,15.68 90.83,29.2 arc90 88.52,31.52 U1.34
  Top 0.305: 89.81,11.74 arc19 JP4.10
CHAN_T
  Top 0.305: CHANCE.1 30.18,0.98 arc90 32.72,3.52 32.72,4.94 arc90 30.18,7.48 CHANCE.3 arc-90 29.21,8.27 JP102.10
CV_B
  Top 0.2: U1.16 77.23,28.08 arc-90 76.89,27.73 arc31 75.59,27.38 arc-2 70.03,24.23 arc58 66.75,19.1 arc24 67.51,13.99 arc2 68.4,11.71
  Top 0.305: 68.4,11.71 68.91,10.05 JP4.2
CV_T
  Top 0.305: JP102.2 CV.3 10.17,13.52 arc-90 7.67,16.02 7.67,17.48 arc-90 10.21,20.02 CV.1
D_B
  Top 0.2: U1.7 69.24,32.31 arc-47 65.51,33.96 arc33 62.85,36.07
  Top 0.305: 62.85,36.07 arc4 JP2.6
D_CV  (via drill 0.35)
  Top 0.305: v29.26,74.13 27.13,73.86 arc68 19.48,67.07 arc0 v18.57,63.44
  Bottom 0.254: U$100.7 30.2,75.07 arc90 v29.26,74.13
  Bottom 0.305: R140.1 C108.2 U102.7 v18.57,63.44
D_OUT_B
  Top 0.2: 97.11,7.21 arc-35 96.02,10.23 arc38 94.85,13.25 arc-40 93.68,16.46 93.68,30.17 arc90 91.14,32.72 U1.37
  Top 0.305: 97.11,7.21 arc35 JP3.7
D_OUT_T
  Top 0.254: 29.23,59.5 arc-83 31.77,56.63 arc14 32.79,48.12 arc-44 32.61,46.91 arc-4 31.42,45.03 arc38 30.63,42.21 arc-4 30.76,36.26 arc36 32,32.17 arc-34 32.46,30.75 32.46,24.55 arc-22 32.11,22.7 arc-2 31.83,22.04 arc45 31.73,18.53 arc-24 32,16.78 32,13.38 arc90 33.93,11.45 34.54,11.45 arc-65 35.59,10.79 arc12 36.52,9.24 arc-11 37.34,7.92 arc3 37.72,7.18
  Top 0.305: LED_D_OUT.K 29.23,59.5 | 37.72,7.18 arc22 JP101.7
  Bottom 0.305: LED_D_OUT.K R138.2
D_T
  Top 0.305: 4.4,53.93 D.4 | D.3 4.4,53.93 | JP100.6 arc90 3.33,38.02 3.33,42.28 arc-19 3.63,44.09 arc10 4.12,45.97 arc-18 4.42,46.88 arc55 4.4,53.93
ENC_A_B
  Top 0.2: 77.28,12.22 arc-32 82.6,18.37
  Top 0.203: 82.6,18.37 arc-5 85.7,20.21 arc63 87.63,22.93 87.63,26.53 arc90 86.13,27.83 arc-55 84.43,28.72 arc56 U1.29
  Top 0.305: 77.28,12.22 arc11 JP4.5
ENC_A_T  (via drill 0.35)
  Top 0.305: JP102.5 15.6,10.94 arc-45 13.72,15.26 13.72,19.63 arc-75 v16.48,23.26
  Bottom 0.305: C116.1 17.17,24.57 | 17.17,24.57 R150.1 | v16.48,23.26 17.17,24.57
ENC_B_B
  Top 0.2: U1.30 83.91,29.91 arc-63 84.71,29.42 arc64 86.27,28.48 arc-90 88.32,26.58 88.32,21.96 arc-67 84.6,16.86 arc40 79.57,12.14
  Top 0.305: 79.57,12.14 arc26 JP4.6
ENC_B_T  (via drill 0.35)
  Top 0.305: v18.72,27.85 18.19,24.1 arc-51 16.64,21.76 arc60 15.32,19.37 15.32,13.78 arc90 17.14,11.95 arc-90 JP102.6
  Bottom 0.305: R146.2 19.39,28.42 arc90 C115.2 arc90 19.95,27.85 v18.72,27.85
ENC_SW_B
  Top 0.2: U1.35 89.17,31.91 arc-90 91.71,29.38 91.71,12.27
  Top 0.305: 91.71,12.27 arc2 JP4.11
ENC_SW_T
  Top 0.305: JP102.11 31.09,10.76 arc26 29.57,11.8 arc-72 28.14,13.78 28.14,20.44 arc27 ENCODER.E
GND  (via drill 0.35)  (1 unrouted)
  Top 0.2: U1.19 78.44,29.66
  Top 0.406: USB.5 93.04,38.55
  Bottom 0.254: U$100.3 28.22,74.57
  Bottom 0.305: IC101.10 36.46,45.99 arc45 36.45,46.02 | 37.74,38.75 arc-45 37.76,38.71 IC101.17 37.76,36.4 arc-45 37.74,36.36
  other vias: 64.54,81.53 11.4,34.64 26.72,49.39 19.51,51.86 15.29,65.45 37.95,77.08 38.07,82.54 17.4,96.28 92.86,80.1 94.97,75.94 88.87,57.5 83.13,67.71 86.31,74.36 81,72.92 77.5,71.62 74.17,53.92 68.94,30.52 65,30.47 84.1,49.29 87.76,45.86 88.93,36.11 91.92,36.09 89.64,29.73 71.65,37.51 21.16,76.93 15.14,76.78 77.29,29.96 79.93,64.99 84.43,54.83 77.98,52.16 84.2,51.76 76.89,24.73 75.49,16.81
  pour Bottom (isolate 0.305): -4.83,116.48 105.66,116.48 105.66,-6.97 -4.83,-6.97
  pour Top (isolate 0.305): -5.59,117.49 107.19,117.49 107.19,-7.73 -5.59,-7.73
I2C0_SCL_B  (via drill 0.35)
  Top 0.203: v86.11,24.89 86.56,25.31 arc48 86.89,26.1 arc-2 86.89,26.56 arc90 86.26,27.22 arc-34 84.3,27.85 arc30 U1.28
  Bottom 0.305: v86.11,24.89 JP3.2
I2C0_SCL_T  (via drill 0.35)
  Top 0.254: 33.93,70.43 arc-17 34.49,66.23 arc9 34.92,59.89 arc-1 36.25,50.33 arc-1 v37.13,42.49 36.98,41.65 arc6 36.37,36.87 arc49 37.72,32.73 arc-50 38.61,30.42 38.61,27.25 arc-12 38.48,26.23 arc11 38.38,24.73 arc-54 37.52,22.93 arc85 37.11,20.92 arc2 37.72,19.96
  Top 0.305: v33.68,71.31 33.93,70.43 | 37.72,19.96 arc9 JP101.2
  Bottom 0.254: U$100.10 31.93,73.42 arc-39 R128.2
  Bottom 0.305: v33.68,71.31 R128.2 | IC101.12 37.76,44 arc-45 v37.13,42.49
I2C0_SDA_B  (via drill 0.35)
  Top 0.203: U1.27 81.63,28.14 arc90 81.89,27.88 82.47,27.88 arc-35 83.84,27.45 arc24 v86.07,26.5
  Bottom 0.305: v86.07,26.5 JP3.1
I2C0_SDA_T  (via drill 0.35)
  Top 0.254: 39.01,22.73 arc24 39.14,23.44 39.14,31.66 arc42 38.35,33.7 arc-52 37.59,36.31 arc5 v38.08,39.97 38.15,42 arc9 38.05,44.37 arc2 36.5,55.52 arc-10 36.04,62.53 arc14 v34.84,74.47
  Top 0.305: JP101.1 39.01,22.73
  Bottom 0.254: U$100.9 34.43,74.06 arc90 v34.84,74.47
  Bottom 0.305: v34.84,74.47 R124.2 | IC101.13 38.41,40.78 arc-45 v38.08,39.97
LA_B
  Top 0.2: U1.2 75.34,34.31 arc-11 74.78,34.36 arc7 71.99,34.72 arc-1 71.66,34.74 arc-72 70.74,35.53 arc-1 69.9,39.26 arc7 68.73,43.45 arc51 63.09,49.12
  Top 0.305: 63.09,49.12 arc9 JP2.1
LA_T
  Top 0.305: A.P$1 arc90 4.79,96.54 3.71,96.54 arc90 1.17,94 1.17,49.78 arc90 JP100.1
LB_B
  Top 0.2: U1.4 74.65,33.52 arc-5 73.16,33.58 arc4 71.35,33.65 arc-70 68.96,35.33 arc3 67.21,39.82 arc60 63.12,43.53
  Top 0.305: 63.12,43.53 arc16 JP2.3
LB_T
  Top 0.305: B.P$1 6.85,83.33 arc90 4.8,85.39 arc90 2.85,83.43 2.85,53.33 arc28 3.15,52.09 arc-39 3.76,47.87 arc-8 3.23,45.86 arc-41 JP100.3
LC_B
  Top 0.2: 63.15,38.58 arc-38 66.78,34.52 arc59 69.95,32.72 U1.6
  Top 0.305: 63.15,38.58 arc19 JP2.5
LC_T
  Bottom 0.305: JP100.5 arc90 4.19,41.42 4.19,45.89 arc-11 4.37,47.74 arc51 3.35,51.71 arc-39 2.54,53.89 2.54,66.72 arc-90 3.91,68.09 arc94 C.P$1
LD_B
  Top 0.2: U1.8 67.95,31.91 arc-29 64.52,32.81 arc16 63.13,33.64
  Top 0.305: 63.13,33.64 arc10 JP2.7
LD_T
  Top 0.305: JP100.7 arc90 4.12,36.26 4.12,40.76 arc-90 5.05,41.7 5.82,41.7 arc90 7.01,42.89 arc-12 7.67,49.19 arc-2 7.92,50.31 arc15 8.08,52.19 8.08,54.22 arc25 D.P$1
LPLAY  (via drill 0.35)
  Top 0.254: 37.03,28.57 arc46 37.52,29.81 arc1 37.52,30.22 arc71 36.5,31.69 arc-55 34.16,34.1 arc-23 33.88,37.3 arc-9 v34.9,42.54
  Top 0.305: PLAY.P$1 37.03,28.57
  Bottom 0.305: IC101.7 34.51,43.47 arc45 v34.9,42.54
MEM_CLK
  Top 0.2: U1.52 78.43,36.64 arc36 77.88,38.36 arc-34 76.78,41.47 arc-13 77.3,48.2 arc10 U$2.6
MEM_CS
  Top 0.2: U1.56 76.29,36.01 arc-33 73.13,40.89 arc-4 71.49,47.41 arc-12 70.69,55.52 arc-82 73.6,58.81 77.42,58.81 arc-90 79.96,56.27 U$2.1
  Top 0.305: R6.1 arc90 91.53,52.89 R5.1 82.5,52.89 arc-90 79.96,55.43 U$2.1
MEM_I00
  Top 0.2: U1.53 78.04,36.67 arc49 77.55,37.74 arc-36 76.14,40.12 arc-26 U$2.5
MEM_I01
  Top 0.2: U1.55 77.23,36.14 arc57 76.94,36.69 arc-33 74.89,39.1 arc-12 72.9,45.39 arc-13 72.45,50.96 72.45,55.06 arc-90 74.99,57.6 77.32,57.6 arc-90 78.69,56.23 U$2.2 arc90 U$2.2
MEM_I02
  Top 0.2: U1.54 77.63,36.45 arc53 77.24,37.25 arc-31 75.46,39.57 arc-19 73.87,46.9 arc-49 76.39,53.16 arc47 U$2.3
MEM_I03
  Top 0.2: U1.51 78.83,36.49 arc0 78.83,37.01 arc29 78.4,38.68 arc-30 77.62,41.35 arc-14 78.68,47.97 arc29 U$2.7
MUTE_B
  Top 0.2: U1.17 77.63,27.84 arc-90 77.04,27.25 arc30 76.28,27.05 arc3 72.14,24.53 arc54 69.27,19.61 arc30 70.9,11.82
  Top 0.305: 70.9,11.82 JP4.3
MUTE_T
  Top 0.305: MUTE.1 17.27,0.98 arc90 19.81,3.52 19.81,4.94 arc90 17.27,7.48 MUTE.3 15.52,7.48 arc-64 JP102.3
N$1
  Top 0.2: U1.21 79.24,28 arc-30 78.58,25.4 arc23 78.33,24.59
  Top 0.305: 78.33,24.59 arc12 R10.2
N$2
  Top 0.2: U1.20 78.83,27.9 arc-85 77.42,26.18 arc79 75.49,23.87 75.49,22.73 Y2.3
  Top 0.305: Y2.3 73.69,22.56 C28.2
N$3
  Top 0.254: R10.1 78.23,20.46 C29.1
  Top 0.305: Y2.1 77.79,20.91 arc-90 78.23,20.46
N$4
  Top 0.406: R1.2 71.72,75.9 arc-90 U$1.4
N$5
  Top 0.406: C3.1 C7.1 | C7.1 C9.1 R1.1 arc-90 70.2,77.93 U$1.5 | L2.2 arc-90 70.23,80.41 C7.1
N$6
  Top 0.406: L1.2 L2.1 arc90 69.98,85.23 C2.1
N$7
  Top 0.406: U$1.1 67.52,72.74 arc-90 C10.2
N$8
  Top 0.406: U$1.6 67.49,75.34 arc90 C10.1 arc90 67.02,74.94 D3.C arc90 62.38,72.81 62.38,70.2 arc90 63.63,68.95 66.9,68.95 arc90 L3.1
N$9
  Top 0.406: U$1.3 73.62,72.74 arc-90 R2.2 73.66,70.92 arc-90 C11.1 R3.2
N$10
  Top 0.406: C11.2 R3.1 | R3.1 71.03,65.85 | 71.03,65.85 C12.2 | L4.1 arc90 71.03,63.94 71.03,65.85 | L3.2 70.14,66.82 arc90 R3.1
N$11  (via drill 0.35)
  Top 0.254: v21.13,40.28 LFD36BUE-101B.11
  Bottom 0.305: IC101.21 35.16,39.34 arc90 32.62,41.88 26.47,41.88 arc33 v21.13,40.28
N$12
  Top 0.2: U1.47 80.43,37.62 arc-43 81.18,39.51 arc8 81.59,40.03 arc39 81.78,40.81 81.78,41.64 arc-90 84.02,43.95 86.02,43.95 arc-81 R8.2
N$13
  Bottom 0.305: BAR.A 32.54,43.33 arc90 33.22,44.01 33.22,44.77 arc90 IC101.5
N$14
  Top 0.2: U1.46 80.83,37.42 arc-47 81.47,38.85 arc41 82.34,40.94 82.34,41.55 arc-90 83.95,43.36 85.89,43.36 arc-90 87.25,41.76 arc58 R9.1
N$15
  Top 0.305: R7.2 92.75,45.9 92.74,45.13 | 92.74,45.13 | 92.74,45.13 C16.1 USB.G4 arc-90 96.24,44.03 USB.G2 | USB.G 96.24,35.69 arc-90 USB.G3
  Bottom 0.406: USB.G3 USB.G4
N$16  (via drill 0.35)
  Top 0.254: v26.67,40.78 LFD36BUE-101B.7
  Bottom 0.305: IC101.22 34.51,38.65 arc90 31.97,41.19 27.08,41.19 arc90 v26.67,40.78
N$17
  Top 0.305: R6.2 91.72,54.72 arc-45 92.29,54.96 SW5.2
  Bottom 0.305: SW5.1 SW5.2
N$18
  Bottom 0.305: IC101.23 33.86,37.86 arc90 31.32,40.4 30.28,40.4 arc22 27.69,39.9 arc-27 25.88,39.62 arc127 LFD36BUE-101B.4
N$19
  Bottom 0.305: IC101.24 33.21,34.69 arc-90 30.67,32.15 19.3,32.15 arc-90 17.63,33.82 arc-51 LFD36BUE-101B.2
N$20
  Bottom 0.254: IC101.25 32.56,36.14 arc-90 30.02,33.6 25.02,33.6 arc-34 22.25,34.43 arc24 21.16,34.87 arc-83 20.09,36.19 20.09,36.87 arc90 18.75,38.22 18.41,38.22 arc49 17.07,37.61
  Bottom 0.305: 17.07,37.61 arc19 LFD36BUE-101B.1
N$21  (via drill 0.35)
  Top 0.254: v25.3,38.32 LFD36BUE-101B.10
  Bottom 0.305: IC101.26 31.91,38.52 arc90 30.73,39.69 arc25 27.64,39.01 arc-17 v25.3,38.32
N$22
  Bottom 0.305: IC101.27 31.26,38.1 arc90 30.4,38.95 arc67 LFD36BUE-101B.5
N$23
  Bottom 0.305: IC101.28 30.61,36.29 arc-90 29.11,34.79 24.05,34.79 arc-47 22.48,35.48 arc19 LFD36BUE-101B.3
N$24
  Bottom 0.305: IC101.1 arc-45 29.08,44.19 18.66,44.19 arc-90 LFD36BUE-101B.12
N$25
  Bottom 0.254: 24.66,45.43 arc61 25.53,44.95 28.96,44.95 arc69 30,45.63 arc-158 31.27,45.41 arc-3 IC101.2
  Bottom 0.305: LFD36BUE-101B.9 24.66,45.43
N$26
  Bottom 0.254: IC101.3 31.83,45.76 arc28 31.57,46.5 arc86 27.3,47.54
  Bottom 0.305: 27.3,47.54 arc42 LFD36BUE-101B.8
N$27  (via drill 0.35)
  Top 0.305: LFD36BUE-101B.6 28.96,41.29 arc-43 30.63,45.66 arc24 v31.85,47.77
  Bottom 0.305: IC101.4 32.56,47.06 arc90 v31.85,47.77
N$28
  Bottom 0.305: R114.1 arc-90 19.39,93.36 C102.1 R115.2 arc29 18.44,89.6 U101.2
N$29
  Bottom 0.305: ALT.DIN 8.69,26.81 arc-64 R147.2
N$30
  Bottom 0.305: CV.DIN 5.55,18.18 arc45 6.3,19.97 6.3,26.89 arc73 ALT.DOUT
N$31
  Bottom 0.305: PRESET.DIN 16.03,16.88 arc-28 CV.DOUT
N$32
  Bottom 0.305: TEMPO.DIN 29.69,17.19 arc-29 PRESET.DOUT
N$33
  Bottom 0.305: CHANCE.DIN arc90 36.63,4.71 36.63,5.07 arc73 35.79,6.21 arc-6 35.18,6.44 arc-1 34.67,6.67 arc-70 33.02,9.49 33.02,10.81 arc-35 34.19,14.5 arc-5 TEMPO.DOUT
N$34
  Bottom 0.305: MUTE.DIN 24.84,1.77 arc103 29.23,3.27 arc-39 CHANCE.DOUT
N$35
  Bottom 0.305: +*-.DIN 10.64,2.58 arc1 11.81,1.79 arc84 15.85,2.38 arc27 16.43,3.55 arc-59 MUTE.DOUT
N$36
  Bottom 0.305: U100.6 U100.7
N$37
  Bottom 0.305: U101.6 R121.2 C104.1 19.77,78.12 arc-90 R123.1
N$38
  Bottom 0.305: R129.1 arc-90 16.22,73.35 17.83,73.35 arc-90 19.39,71.79 R132.2 C106.1 arc33 18.72,68.22 U102.2
N$39
  Bottom 0.305: U102.6 C108.1 R140.2 arc-90 18.58,56.81 17.93,56.81 arc-90 16.22,58.53 R139.1
N$40
  Bottom 0.305: R148.1 PLAY.P$2
N$41
  Bottom 0.305: A.P$2 6.88,88.27 R117.1
N$42
  Bottom 0.305: B.P$2 6.85,74.12 R126.1
N$43
  Top 0.406: POWER.10 POWER.9 93.47,86.59 F2.2
N$44
  Top 0.406: F2.1 arc-90 94.63,83.26 D2.A
N$45
  Top 0.406: POWER.1 POWER.2 83.31,88.54 F1.2
N$46
  Top 0.406: F1.1 77.66,88.05 arc45 D1.C
N$47
  Bottom 0.305: C.P$2 6.85,62.61 R135.1
N$48
  Bottom 0.305: D.P$2 6.85,50.59 R142.1
N$49
  Bottom 0.305: R116.2 A_OUT.P3
N$50
  Bottom 0.305: R122.2 B_OUT.P3
N$51
  Bottom 0.305: R105.1 Q102.1 R102.2
N$52
  Bottom 0.305: R134.2 C_OUT.P3
N$53
  Bottom 0.305: R101.1 R100.2 30.06,108.6 Q101.1
N$54
  Bottom 0.305: R141.2 D_OUT.P3
N$55
  Bottom 0.305: Q100.1 R109.1
N$56
  Bottom 0.305: A_CV.P3 15.23,93.44 arc-90 R114.2
N$57
  Bottom 0.305: R123.2 17,77.61 arc-90 B_CV.P3
N$58
  Bottom 0.305: R129.2 C_CV.P3
N$59
  Bottom 0.305: D_CV.P3 arc-45 14.52,58.29 R139.2
N$60
  Bottom 0.305: ST/SP.P3 R103.2
N$61
  Bottom 0.305: Q100.3 R106.2 R103.1
N$62
  Bottom 0.305: SYNC.P3 5.33,109.42 R105.2
N$63
  Bottom 0.305: PRESE.P3 R104.2
N$64
  Bottom 0.305: RESE.P3 R101.2
N$65
  Bottom 0.305: ENCODER.A arc-90 13.53,31.04 R145.2 arc17 16.82,30.01 R146.1
N$66
  Bottom 0.305: ENCODER.C arc90 13.29,24.53 R150.2 15.15,26.64 arc-90 R149.2
N$67
  Bottom 0.305: R143.2 5.48,46.37 BAR.K
N$68
  Bottom 0.305: IC101.6 33.86,43.84 arc-90 32.64,42.61 25.78,42.61 arc14 BEAT.A
N$69
  Bottom 0.305: R144.2 BEAT.K
N$71
  Top 0.305: USB.3 93.24,39.8 arc-55 R8.1
N$72
  Bottom 0.305: R104.1 C100.1 R107.2 U100.2
N$73
  Bottom 0.254: U$100.1 26.11,73.37 arc-28 R127.1
N$74
  Bottom 0.254: U$100.2 26.06,74.06 arc-50 25.3,74.41 arc30 R125.2
N$75
  Bottom 0.305: R111.1 Q103.1
N$76
  Bottom 0.305: R116.1 Q103.3 34.8,91.5 arc90 R113.2
N$77
  Bottom 0.305: LED_A_OUT.A R112.2
N$78  (via drill 0.35)
  Top 0.305: v92.91,40.65 arc90 93.32,40.51 USB.2 | v91.53,39 R9.2
  Bottom 0.305: v92.91,40.65 92.44,40.27 arc18 v91.53,39
N$79
  Bottom 0.305: R120.1 Q104.1
N$80
  Bottom 0.305: R122.1 Q104.3 35,82.1 arc90 R118.2
N$81
  Bottom 0.305: R119.2 25.84,82.84 arc-90 LED_B_OUT.A
N$83
  Bottom 0.305: R130.1 Q105.1
N$84
  Bottom 0.305: Q105.3 34.18,65.91 34.29,65.42 R134.1 36.58,65.42 R133.2
N$85
  Bottom 0.305: LED_C_OUT.A R131.2
N$86  (via drill 0.35)
  Top 0.2: U1.23 80.02,26.63 arc67 81.36,24.58 | U1.50 79.24,37.63 arc10 v78.95,39.87 | U1.45 81.23,37.08 arc-51 81.79,38.26 arc36 82.98,40.1 arc-51 C19.1
  Top 0.254: v78.95,39.87 C17.2 | v83.87,42.38 C19.1
  Top 0.305: 81.36,24.58 arc20 v81.89,24.41 C27.2
  Bottom 0.254: v81.89,24.41 82.6,24.4 arc95 83.67,25.54 arc-8 83.64,30.62 arc9 83.59,36.62 arc-13 83.77,42.16 arc-31 v83.87,42.38
  Bottom 0.305: v81.89,24.41 81.49,24.41 arc-90 78.95,26.95 v78.95,39.87
N$87
  Bottom 0.305: R138.1 Q106.1
N$88
  Bottom 0.305: R141.1 34.37,55.33 Q106.3 34.54,55.43 arc90 37.08,57.97 R137.2
N$89
  Bottom 0.305: LED_D_OUT.A R136.2
NEO_B
  Top 0.2: 63.92,29.49 73.28,29.49 arc62 73.79,29.79 arc-57 75.19,30.7 arc-8 U1.11
  Top 0.305: JP2.9 arc-90 62.24,29.19 63.92,29.49
NEO_T
  Bottom 0.305: JP100.9 2.64,29.96 arc32 3.07,31.06 arc-140 5.54,31.69 arc11 R147.1
PLAY_B
  Top 0.2: U1.32 84.39,30.72 arc-66 85.44,30.03 arc68 86.32,29.48 87.35,29.48 arc-90 89.89,26.94 89.89,17.42 arc-43 88.1,12.85 arc4 87.4,12.04
  Top 0.305: 87.4,12.04 arc37 JP4.9
PLAY_T
  Top 0.305: JP102.9 26.64,19.22 arc26 25.81,22.8 arc-17 25.17,24.81 arc-75 27.05,28.26 arc10 PLAY.4
  Bottom 0.305: PLAY.4 PLAY.3
PRESE_CV_B  (via drill 0.35)
  Top 0.2: U1.41 85.55,34.31 arc45 v86.38,34.66
  Bottom 0.305: JP4.8 84.12,18.53 arc-25 85.04,22.67 arc35 85.22,24.05 arc-15 85.09,26.89 arc-20 85.47,28.29 arc35 v86.38,34.66
PRESE_CV_T  (via drill 0.35)
  Top 0.305: v19.41,103.62 19.53,102.76 arc-23 20.45,93.11 arc88 23.88,88.74 arc-155 24.26,84.14 arc71 16.28,73.55 arc17 16.69,70.25 arc-26 16.84,66.29 arc44 17.65,62.09 arc-71 17.2,51.25 arc-2 15.32,48.91 arc43 14.35,46.17 14.4,36.14 arc61 16.79,32.05 arc-41 23.67,23.87 arc4 24.36,22.11 arc-24 24.77,20.08 25.12,14.01 arc-21 JP102.8
  Bottom 0.305: C100.2 14.99,104.01 R107.1 U100.1 19.3,103.65 v19.41,103.62
PREST_B
  Top 0.2: U1.31 84.26,30.32 arc-63 84.99,29.88 arc67 86.48,29.04 86.52,29.04 arc-90 89.05,26.61 89.05,21.12 arc-64 84.36,13.84 arc31 82.22,11.99
  Top 0.305: 82.22,11.99 arc32 JP4.7
PREST_T
  Top 0.305: PRESET.1 22.86,20.02 arc90 20.32,17.48 20.32,16.06 arc90 22.86,13.52 PRESET.3 arc90 21.59,11.96 JP102.7
RESE_CV_B
  Top 0.2: U1.13 75.49,29.91 arc55 75.06,29.69 arc4 74.83,29.33 arc-40 73.87,28.55 arc-2 63.33,24.81
  Top 0.305: 63.33,24.81 arc-12 JP2.11
RESE_CV_T  (via drill 0.35)
  Top 0.305: v26.39,105.81 22.2,107.2 arc117 16.69,102.48 arc-12 17.17,98.16 arc-56 16.54,97.12 arc9 14.76,95.88 arc-7 14.12,95.42 arc61 12.45,92.17 12.45,65.17 arc38 13.08,63.34 arc-35 13.77,61.51 13.77,53.81 arc-26 13.08,50.79 arc-8 12.55,49.85 arc33 11.68,47.08 arc2 11.68,45.28 arc-27 8.91,32.63 arc23 7.16,25.72 arc-135 JP100.11
  Bottom 0.305: v26.39,105.81 Q101.3 27.35,103.6 arc-90 R108.1
RUN  (via drill 0.35)
  Top 0.2: U1.26 81.23,27.99 arc90 81.83,27.39 82.47,27.39 arc-90 84.25,25.15 v84.25,23.61
  Top 0.305: R4.2 arc90 87.38,58.48 J1.10
  Bottom 0.305: J1.10 arc11 84.75,34.45 arc-7 84.35,27.7 arc11 84.3,25.42 arc-12 v84.25,23.61
ST/SP_B
  Top 0.2: U1.18 78.03,27.48 arc-90 77.37,26.82 arc34 76.46,26.54 arc-6 73.92,25.02 arc66 71.78,21.18 arc13 73.46,11.97
  Top 0.305: 73.46,11.97 73.94,10.05 JP4.4
ST/SP_T  (via drill 0.35)
  Top 0.305: v30.23,101.74 28.8,102.63 arc19 21.69,105.55 arc15 20.52,105.66 arc96 18.19,102.81 arc-14 18.75,97.63 arc-6 17.73,90.49 arc-33 15.95,87.14 arc42 13.82,82.21 13.82,66.06 arc37 14.43,63.9 arc-35 17.14,56.1 arc-38 16.13,52.9 arc6 14.12,49.9 arc36 13.03,46.14 arc-11 12.65,39.01 arc39 13.82,32.73 arc-57 14.1,24.1 arc-17 13.56,23.33 arc41 12.17,20.01 12.17,14.37 arc45 JP102.4
  Bottom 0.305: R109.2 v30.23,101.74
SWCLK  (via drill 0.35)
  Top 0.2: U1.24 80.43,27.29 arc90 82.26,25.46 82.69,25.46 arc90 v82.77,25.56
  Bottom 0.305: v82.77,25.56 81.84,68.3 arc0 81.79,69.51 arc-65 85.33,75.61 arc-27 JP1.2 arc88 90.45,72.7 arc-48 88.75,69.93 J1.4
SWDI0  (via drill 0.35)
  Top 0.2: U1.25 80.83,27.74 arc90 v81.81,26.49
  Top 0.406: J1.2 88.24,72.66 arc-23 JP1.3
  Bottom 0.305: v81.81,26.49 81.19,40.06 arc6 78.25,63.06 arc-116 JP1.3
SYNC_CV_B
  Top 0.2: U1.12 75.47,30.31 arc55 74.32,29.72 arc-3 74.12,29.44 arc-39 73.46,29 arc-7 63.7,27.16
  Top 0.305: 63.7,27.16 arc-2 JP2.10
SYNC_CV_T  (via drill 0.35)
  Top 0.305: v8.38,102 8.38,99.89 arc49 10.21,95.9 arc-50 11.15,93.79 11.15,64.56 arc34 11.61,63.06 arc-34 12.57,59.86 12.57,53.64 arc-41 11.56,50.89 arc45 10.36,47.26 arc-29 8.08,34.69 arc4 6.76,31.59 arc-47 4.98,29.81 arc-4 4.55,29.66 arc60 3.5,28.52 arc-52 JP100.10
  Bottom 0.305: R110.1 Q102.3 v8.38,102
TEMP_B
  Top 0.2: 93.93,11.86 arc9 93.43,12.73 arc-34 92.64,15.27 92.64,29.77 arc90 90.1,32.31 U1.36
  Top 0.305: 93.93,11.86 arc-29 JP4.12
TEMP_T
  Bottom 0.305: TEMPO.1 arc-90 36.47,19.55 36.47,13.99 arc-90 TEMPO.3 36,11.76 arc-90 JP102.12
TOR  (via drill 2.2 pad 3.81)  (5 unrouted)
  other vias: 13.72,4.23 26.57,4.23 73.85,4.23 86.48,4.23 11.94,97.93 71.94,97.93
VCC
  Top 0.2: 73.81,30.83 arc-30 74.86,31.11 U1.10 76.53,31.12 arc90 77,31.58 77,34.07 arc90 76.35,34.72 | 80.06,23.97 arc-36 79.57,26.1 arc11 79.63,26.79 U1.22 79.63,29.14 arc-90 80.1,29.61 80.87,29.61 arc90 81.89,30.69 81.89,31.64 arc90 81.89,31.65 | C18.2 arc34 79.63,37.78 U1.49 79.82,35.55 | C20.1 arc40 83.17,38.78 arc-14 82.26,37.8 arc50 81.63,36.46 U1.44 U1.43 | U1.48 79.82,35.55 | U1.43 arc-90 U1.42 | U1.43 82.03,36.16 arc-63 82.78,37.38 arc-30 C21.1 | C22.2 84.2,36.05 arc90 U1.42 | C24.2 arc37 84.82,31.12 U1.33 82.42,31.12 arc-90 81.89,31.65 | U1.1 76.35,34.72 | 76.35,34.72 79.83,34.72 | 79.83,34.72 82.49,34.72 | 82.49,34.72 U1.42 | 81.89,31.65 81.89,34.11 arc-90 82.49,34.72 | 79.82,35.55 arc-90 79.83,35.54 79.83,34.72
  Top 0.254: U1.1 C23.2 73.82,36.25 73.62,36.68 arc7 72.61,38.57 arc-25 71.13,42.88 arc23 69.47,47.98 arc-67 L4.2 | U$2.8 C15.1 C14.1
  Top 0.305: 73.81,30.83 arc-28 C25.2 | 80.06,23.97 arc-12 C26.2 | U$2.8 arc-90 81.73,50.63 93.98,50.63 arc90 96.52,53.17 96.52,54.75 arc90 94.49,56.79 91.1,56.79 arc90 R5.2 87.8,54.59 arc-90 85.26,57.13 R4.1 84.57,58.06 arc-90 82.03,60.6 82.03,69.38 arc-90 84.17,71.52 J1.1
  Top 0.406: C13.+ arc90 66.75,60.47 L4.2 72.01,60.98 arc62 76.4,65.88 arc-91 J1.1